# EAGLE design ab_v10 (EAGLE 6.1)
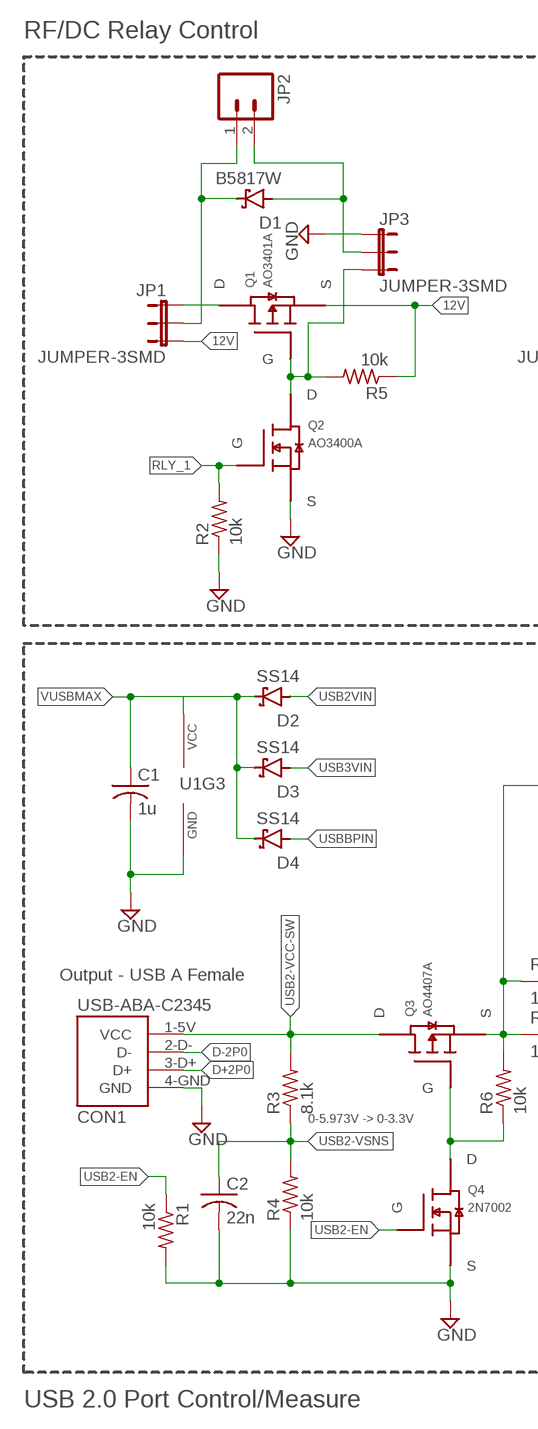
[diagram p0: schematic, sheet 1, part 1 of 2]
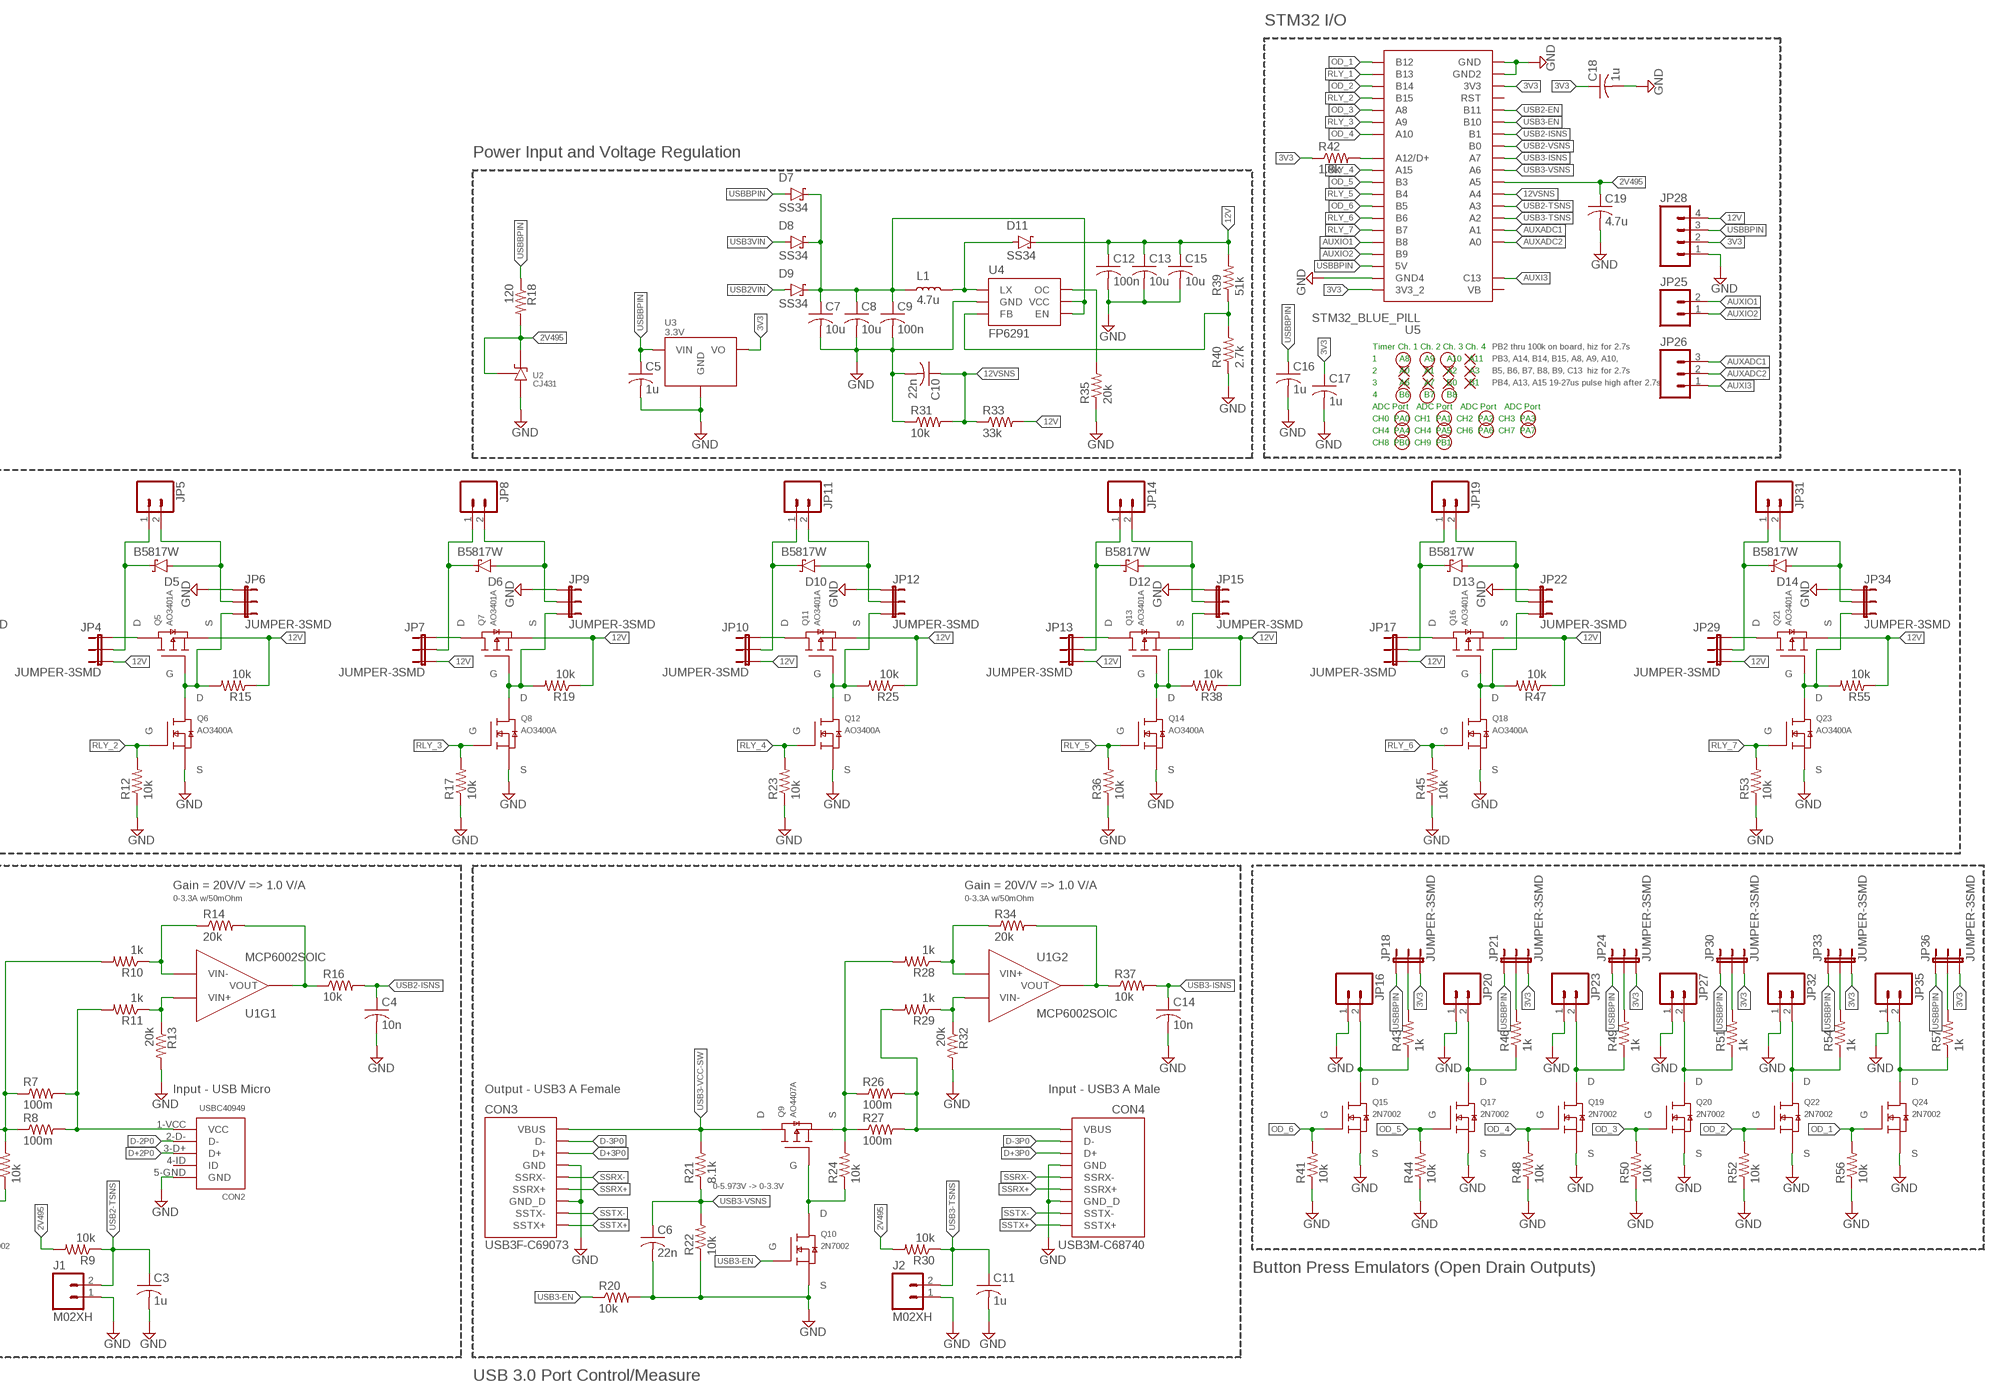
[diagram p1: schematic, sheet 1, part 2 of 2]

## Parts
C1  1u  C-USC0402  [C0402]
C2  22n  C-USC0402  [C0402]
C3  1u  C-USC0402  [C0402]
C4  10n  C-USC0402  [C0402]
C5  1u  C-USC0402  [C0402]
C6  22n  C-USC0402  [C0402]
C7  10u  C-USC0603  [C0603]
C8  10u  C-USC0603  [C0603]
C9  100n  C-USC0402  [C0402]
C10  22n  C-USC0402  [C0402]
C11  1u  C-USC0402  [C0402]
C12  100n  C-USC0402  [C0402]
C13  10u  C-USC0805  [C0805]
C14  10n  C-USC0402  [C0402]
C15  10u  C-USC0805  [C0805]
C16  1u  C-USC0402  [C0402]
C17  1u  C-USC0402  [C0402]
C18  1u  C-USC0402  [C0402]
C19  4.7u  C-USC0402  [C0402]
CON1  USB-ABA-C2345  [USB_A_C2345]
CON2  USBC40949  [MICRO_USB-B_C40949]
CON3  USB3F-C69073  [USB3-F-C69073]
CON4  USB3M-C68740  [USB3-M-C68740]
D1  B5817W  PMEG3020ER  [SOD123W]
D2  SS14  DIODE_SCHOTTKY_SMSSMA  [SMA]
D3  SS14  DIODE_SCHOTTKY_SMSSMA  [SMA]
D4  SS14  DIODE_SCHOTTKY_SMSSMA  [SMA]
D5  B5817W  PMEG3020ER  [SOD123W]
D6  B5817W  PMEG3020ER  [SOD123W]
D7  SS34  DIODE_SCHOTTKY_SMSSMA  [SMA]
D8  SS34  DIODE_SCHOTTKY_SMSSMA  [SMA]
D9  SS34  DIODE_SCHOTTKY_SMSSMA  [SMA]
D10  B5817W  PMEG3020ER  [SOD123W]
D11  SS34  DIODE_SCHOTTKY_SMSSMA  [SMA]
D12  B5817W  PMEG3020ER  [SOD123W]
D13  B5817W  PMEG3020ER  [SOD123W]
D14  B5817W  PMEG3020ER  [SOD123W]
J1  M02XH  [B2B-XH-A]
J2  M02XH  [B2B-XH-A]
JP1  JUMPER-3SMD  [SJ_3]
JP2  M02PTH  [1X02]
JP3  JUMPER-3SMD  [SJ_3]
JP4  JUMPER-3SMD  [SJ_3]
JP5  M02PTH  [1X02]
JP6  JUMPER-3SMD  [SJ_3]
JP7  JUMPER-3SMD  [SJ_3]
JP8  M02PTH  [1X02]
JP9  JUMPER-3SMD  [SJ_3]
JP10  JUMPER-3SMD  [SJ_3]
JP11  M02PTH  [1X02]
JP12  JUMPER-3SMD  [SJ_3]
JP13  JUMPER-3SMD  [SJ_3]
JP14  M02PTH  [1X02]
JP15  JUMPER-3SMD  [SJ_3]
JP16  M02PTH  [1X02]
JP17  JUMPER-3SMD  [SJ_3]
JP18  JUMPER-3SMD  [SJ_3]
JP19  M02PTH  [1X02]
JP20  M02PTH  [1X02]
JP21  JUMPER-3SMD  [SJ_3]
JP22  JUMPER-3SMD  [SJ_3]
JP23  M02PTH  [1X02]
JP24  JUMPER-3SMD  [SJ_3]
JP25  M02PTH  [1X02]
JP26  M03PTH  [1X03]
JP27  M02PTH  [1X02]
JP28  M04PTH  [1X04]
JP29  JUMPER-3SMD  [SJ_3]
JP30  JUMPER-3SMD  [SJ_3]
JP31  M02PTH  [1X02]
JP32  M02PTH  [1X02]
JP33  JUMPER-3SMD  [SJ_3]
JP34  JUMPER-3SMD  [SJ_3]
JP35  M02PTH  [1X02]
JP36  JUMPER-3SMD  [SJ_3]
L1  4.7u  INDUCTOR6X6  [INDUCTOR_6X6]
Q1  AO3401A  [SOT23]
Q2  AO3400A  2N7002P  [SOT23]
Q3  AO4407A  P-MOSFET-SOIC8  [8-SOIC]
Q4  2N7002  2N7002P  [SOT23]
Q5  AO3401A  [SOT23]
Q6  AO3400A  2N7002P  [SOT23]
Q7  AO3401A  [SOT23]
Q8  AO3400A  2N7002P  [SOT23]
Q9  AO4407A  P-MOSFET-SOIC8  [8-SOIC]
Q10  2N7002  2N7002P  [SOT23]
Q11  AO3401A  [SOT23]
Q12  AO3400A  2N7002P  [SOT23]
Q13  AO3401A  [SOT23]
Q14  AO3400A  2N7002P  [SOT23]
Q15  2N7002  2N7002P  [SOT23]
Q16  AO3401A  [SOT23]
Q17  2N7002  2N7002P  [SOT23]
Q18  AO3400A  2N7002P  [SOT23]
Q19  2N7002  2N7002P  [SOT23]
Q20  2N7002  2N7002P  [SOT23]
Q21  AO3401A  [SOT23]
Q22  2N7002  2N7002P  [SOT23]
Q23  AO3400A  2N7002P  [SOT23]
Q24  2N7002  2N7002P  [SOT23]
R1  10k  R-US_R0402  [R0402]
R2  10k  R-US_R0402  [R0402]
R3  8.1k  R-US_R0402  [R0402]
R4  10k  R-US_R0402  [R0402]
R5  10k  R-US_R0402  [R0402]
R6  10k  R-US_R0402  [R0402]
R7  100m  R-US_R1206  [R1206]
R8  100m  R-US_R1206  [R1206]
R9  10k  R-US_R0402  [R0402]
R10  1k  R-US_R0402  [R0402]
R11  1k  R-US_R0402  [R0402]
R12  10k  R-US_R0402  [R0402]
R13  20k  R-US_R0402  [R0402]
R14  20k  R-US_R0402  [R0402]
R15  10k  R-US_R0402  [R0402]
R16  10k  R-US_R0402  [R0402]
R17  10k  R-US_R0402  [R0402]
R18  120  R-US_R0402  [R0402]
R19  10k  R-US_R0402  [R0402]
R20  10k  R-US_R0402  [R0402]
R21  8.1k  R-US_R0402  [R0402]
R22  10k  R-US_R0402  [R0402]
R23  10k  R-US_R0402  [R0402]
R24  10k  R-US_R0402  [R0402]
R25  10k  R-US_R0402  [R0402]
R26  100m  R-US_R1206  [R1206]
R27  100m  R-US_R1206  [R1206]
R28  1k  R-US_R0402  [R0402]
R29  1k  R-US_R0402  [R0402]
R30  10k  R-US_R0402  [R0402]
R31  10k  R-US_R0402  [R0402]
R32  20k  R-US_R0402  [R0402]
R33  33k  R-US_R0402  [R0402]
R34  20k  R-US_R0402  [R0402]
R35  20k  R-US_R0402  [R0402]
R36  10k  R-US_R0402  [R0402]
R37  10k  R-US_R0402  [R0402]
R38  10k  R-US_R0402  [R0402]
R39  51k  R-US_R0402  [R0402]
R40  2.7k  R-US_R0402  [R0402]
R41  10k  R-US_R0402  [R0402]
R42  1.8k  R-US_R0402  [R0402]
R43  1k  R-US_R0402  [R0402]
R44  10k  R-US_R0402  [R0402]
R45  10k  R-US_R0402  [R0402]
R46  1k  R-US_R0402  [R0402]
R47  10k  R-US_R0402  [R0402]
R48  10k  R-US_R0402  [R0402]
R49  1k  R-US_R0402  [R0402]
R50  10k  R-US_R0402  [R0402]
R51  1k  R-US_R0402  [R0402]
R52  10k  R-US_R0402  [R0402]
R53  10k  R-US_R0402  [R0402]
R54  1k  R-US_R0402  [R0402]
R55  10k  R-US_R0402  [R0402]
R56  10k  R-US_R0402  [R0402]
R57  1k  R-US_R0402  [R0402]
U1  MCP6002SOIC  [8-SOIC]
U2  CJ431  TL431SOT23  [SOT23]
U3  3.3V  AP1117UR133-B  [SOT-89]
U4  FP6291  [SOT23-6]
U5  STM32_BLUE_PILL  [STM32_BLUE_PILL_USABLE]

## Nets
2V495: C19.1 R9.2 R18.2 R30.2 U2.1(K) U2.2(REF) U5.A5
3V3: C17.1 C18.1 JP18.3 JP21.3 JP24.3 JP28.2 JP30.3 JP33.3 JP36.3 R42.1 U3.1(VO) U5.3V3 U5.3V3_2
12V: C12.1 C13.1 C15.1 D11.K(CATHODE) JP1.3 JP4.3 JP7.3 JP10.3 JP13.3 JP17.3 JP28.4 JP29.3 Q1.2(S) Q5.2(S) Q7.2(S) Q11.2(S) Q13.2(S) Q16.2(S) Q21.2(S) R5.1 R15.1 R19.1 R25.1 R33.2 R38.1 R39.2 R47.1 R55.1
12VSNS: C10.1 R31.2 R33.1 U5.A4
AUXADC1: JP26.3 U5.A1
AUXADC2: JP26.2 U5.A0
AUXI3: JP26.1 U5.C13
AUXIO1: JP25.2 U5.B8
AUXIO2: JP25.1 U5.B9
BOOSTVCC: C7.1 C8.1 C9.1 D7.K(CATHODE) D8.K(CATHODE) D9.K(CATHODE) L1.1 U4.4(EN) U4.5(VCC)
D+2P0: CON1.3-D+(D+) CON2.3-D+(D+)
D+3P0: CON3.3-D+(D+) CON4.3-D+(D+)
D-2P0: CON1.2-D-(D-) CON2.2-D-(D-)
D-3P0: CON3.2-D-(D-) CON4.2-D-(D-)
FB: R39.1 R40.2 U4.3(FB)
GND: C1.2 C2.2 C3.2 C4.2 C5.2 C6.2 C7.2 C8.2 C9.2 C10.2 C11.2 C12.2 C13.2 C14.2 C15.2 C16.2 C17.2 C18.2 C19.2 CON1.4-GND(GND) CON2.5-GND(GND) CON3.4-GND(GND) CON3.7-GND(GND_D) CON4.4-GND(GND) CON4.7-GNDD(GND_D) J1.1 J2.1 JP3.1 JP6.1 JP9.1 JP12.1 JP15.1 JP16.1 JP20.1 JP22.1 JP23.1 JP27.1 JP28.1 JP32.1 JP34.1 JP35.1 Q2.2(S) Q4.2(S) Q6.2(S) Q8.2(S) Q10.2(S) Q12.2(S) Q14.2(S) Q15.2(S) Q17.2(S) Q18.2(S) Q19.2(S) Q20.2(S) Q22.2(S) Q23.2(S) Q24.2(S) R1.2 R2.1 R4.1 R12.1 R13.2 R17.1 R20.2 R22.1 R23.1 R31.1 R32.2 R35.1 R36.1 R40.1 R41.1 R44.1 R45.1 R48.1 R50.1 R52.1 R53.1 R56.1 U1.4(GND) U2.3(A) U3.2(GND) U3.2@1(GND) U4.2(GND) U5.GND U5.GND2 U5.GND4
N$1: JP16.2 Q15.3(D) R43.1
N$2: Q9.4(G) Q10.3(D) R24.1
N$3: R10.1 R14.1 U1.2(VIN-)
N$4: R11.1 R13.1 U1.3(VIN+)
N$5: JP21.2 R46.2
N$6: JP18.2 R43.2
N$7: Q3.4(G) Q4.3(D) R6.1
N$8: JP20.2 Q17.3(D) R46.1
N$9: JP24.2 R49.2
N$10: JP23.2 Q19.3(D) R49.1
N$11: JP30.2 R51.2
N$12: JP27.2 Q20.3(D) R51.1
N$13: JP33.2 R54.2
N$14: JP32.2 Q22.3(D) R54.1
N$15: JP36.2 R57.2
N$16: R28.1 R34.1 U1.5(VIN+)
N$17: R29.1 R32.1 U1.6(VIN-)
N$18: JP35.2 Q24.3(D) R57.1
N$20: JP6.3 Q5.1(G) Q6.3(D) R15.2
N$26: R42.2 U5.A12(A12/D+)
OC: R35.2 U4.6(OC)
OD_1: Q24.1(G) R56.2 U5.B12
OD_2: Q22.1(G) R52.2 U5.B14
OD_3: Q20.1(G) R50.2 U5.A8
OD_4: Q19.1(G) R48.2 U5.A10
OD_5: Q17.1(G) R44.2 U5.B3
OD_6: Q15.1(G) R41.2 U5.B5
RLY1-SW: D1.K(CATHODE) JP1.2 JP2.1
RLY1-SW1: D5.K(CATHODE) JP4.2 JP5.1
RLY1-SW2: D6.K(CATHODE) JP7.2 JP8.1
RLY1-SW3: D10.K(CATHODE) JP10.2 JP11.1
RLY1-SW4: D12.K(CATHODE) JP13.2 JP14.1
RLY1-SW5: D13.K(CATHODE) JP17.2 JP19.1
RLY1-SW6: D14.K(CATHODE) JP29.2 JP31.1
RLY1D: JP1.1 Q1.3(D)
RLY1D1: JP4.1 Q5.3(D)
RLY1D2: JP7.1 Q7.3(D)
RLY1D3: JP10.1 Q11.3(D)
RLY1D4: JP13.1 Q13.3(D)
RLY1D5: JP17.1 Q16.3(D)
RLY1D6: JP29.1 Q21.3(D)
RLY1DG: JP3.3 Q1.1(G) Q2.3(D) R5.2
RLY1DG2: JP9.3 Q7.1(G) Q8.3(D) R19.2
RLY1DG3: JP12.3 Q11.1(G) Q12.3(D) R25.2
RLY1DG4: JP15.3 Q13.1(G) Q14.3(D) R38.2
RLY1DG5: JP22.3 Q16.1(G) Q18.3(D) R47.2
RLY1DG6: JP34.3 Q21.1(G) Q23.3(D) R55.2
RLY1SPLY: D1.A(ANODE) JP2.2 JP3.2
RLY1SPLY1: D5.A(ANODE) JP5.2 JP6.2
RLY1SPLY2: D6.A(ANODE) JP8.2 JP9.2
RLY1SPLY3: D10.A(ANODE) JP11.2 JP12.2
RLY1SPLY4: D12.A(ANODE) JP14.2 JP15.2
RLY1SPLY5: D13.A(ANODE) JP19.2 JP22.2
RLY1SPLY6: D14.A(ANODE) JP31.2 JP34.2
RLY_1: Q2.1(G) R2.2 U5.B13
RLY_2: Q6.1(G) R12.2 U5.B15
RLY_3: Q8.1(G) R17.2 U5.A9
RLY_4: Q12.1(G) R23.2 U5.A15
RLY_5: Q14.1(G) R36.2 U5.B4
RLY_6: Q18.1(G) R45.2 U5.B6
RLY_7: Q23.1(G) R53.2 U5.B7
SSRX+: CON3.6-SSRX+(SSRX+) CON4.6-SSRX+(SSRX+)
SSRX-: CON3.5-SSRX-(SSRX-) CON4.5-SSRX-(SSRX-)
SSTX+: CON3.9-SSTX+(SSTX+) CON4.9-SSTX+(SSTX+)
SSTX-: CON3.8-SSTX-(SSTX-) CON4.8-SSTX-(SSTX-)
SW: D11.A(ANODE) L1.2 U4.1(LX)
USB2-EN: Q4.1(G) R1.1 U5.B11
USB2-ISNS: C4.1 R16.2 U5.B1
USB2-ISNS-R: R14.2 R16.1 U1.1(VOUT)
USB2-TSNS: C3.1 J1.2 R9.1 U5.A3
USB2-VCC-SW: CON1.1-5V(VCC) Q3.5(D) Q3.6(D) Q3.7(D) Q3.8(D) R3.2
USB2-VSNS: C2.1 R3.1 R4.2 U5.B0
USB2VIN: CON2.1-VCC(VCC) D2.A(ANODE) D9.A(ANODE) R7.2 R8.2 R11.2
USB3-EN: Q10.1(G) R20.1 U5.B10
USB3-ISNS: C14.1 R37.2 U5.A7
USB3-ISNS-R: R34.2 R37.1 U1.7(VOUT)
USB3-TSNS: C11.1 J2.2 R30.1 U5.A2
USB3-VCC-SW: CON3.1-VBUS(VBUS) Q9.5(D) Q9.6(D) Q9.7(D) Q9.8(D) R21.2
USB3-VSNS: C6.1 R21.1 R22.2 U5.A6
USB3OUTVCC: Q9.1(S) Q9.2(S) Q9.3(S) R24.2 R26.1 R27.1 R28.2
USB3VIN: CON4.1-VBUS(VBUS) D3.A(ANODE) D8.A(ANODE) R26.2 R27.2 R29.2
USBBPIN: C5.1 C16.1 D4.A(ANODE) D7.A(ANODE) JP18.1 JP21.1 JP24.1 JP28.3 JP30.1 JP33.1 JP36.1 R18.1 U3.3(VIN) U5.5V
USBOUTVCC: Q3.1(S) Q3.2(S) Q3.3(S) R6.2 R7.1 R8.1 R10.2
VUSBMAX: C1.1 D2.K(CATHODE) D3.K(CATHODE) D4.K(CATHODE) U1.8(VCC)
Unconnected: CON2.4-ID(ID) U5.RST U5.VBAT(VB)

## Notes on the sheet
- STM32 I/O
- Power Input and Voltage Regulation
- Timer Ch. 1 Ch. 2 Ch. 3 Ch. 4 | PB2 thru 100k on board, hiz for 2.7s
- 1         A8      A9     A10   A11 | PB3, A14, B14, B15, A8, A9, A10,
- 2         A0      A1     A2     A3 | B5, B6, B7, B8, B9, C13  hiz for 2.7s
- 3         A6      A7     B0     B1 | PB4, A13, A15 19-27us pulse high after 2.7s
- 4         B6      B7     B8
- ADC Port   ADC Port   ADC Port   ADC Port
- CH0  PA0  CH1  PA1  CH2  PA2  CH3  PA3
- CH4  PA4  CH4  PA5  CH6  PA6  CH7  PA7
- CH8  PB0  CH9  PB1
- RF/DC Relay Control
- Gain = 20V/V => 1.0 V/A | Gain = 20V/V => 1.0 V/A
- 0-3.3A w/50mOhm | 0-3.3A w/50mOhm
- Output - USB A Female | Input - USB Micro | Output - USB3 A Female | Input - USB3 A Male
- 0-5.973V -> 0-3.3V | 0-5.973V -> 0-3.3V
- Button Press Emulators (Open Drain Outputs)
- USB 2.0 Port Control/Measure | USB 3.0 Port Control/Measure

## Library data of the parts
C1-C19 = resistor:C-US: CAPACITOR, American symbol
CON1 = custom:USB-AB
CON2 = custom:USB
CON3 CON4 = custom:USB3
D1 D5 D6 D10 D12-D14 = custom:PMEG3020ER: Schottky Diode 30V 2A 0.42V 1.5mA Leakage
D2-D4 D7-D9 D11 = custom:DIODE_SCHOTTKY_SMS
J1 J2 = custom:M02: 2-pin Header
JP1 JP3 JP4 JP6 JP7 JP9 JP10 JP12 JP13 JP15 JP17 JP18 JP21 JP22 JP24 JP29 JP30 JP33 JP34 JP36 = SparkFun:JUMPER-3
JP2 JP5 JP8 JP11 JP14 JP16 JP19 JP20 JP23 JP25 JP27 JP31 JP32 JP35 = SparkFun:M02: Header 2 Standard 2-pin 0.1" header. Use with straight break away headers (SKU : PRT-00116), right angle break away headers (PRT-00553), swiss pins (PRT-00743), machine pins (PRT-00117), and female headers (PRT-00115). Molex polarized connector foot print use with SKU : PRT-08233 with associated crimp pins and housings.
JP26 = SparkFun:M03: Header 3 Standard 3-pin 0.1" header. Use with straight break away headers (SKU : PRT-00116), right angle break away headers (PRT-00553), swiss pins (PRT-00743), machine pins (PRT-00117), and female headers (PRT-00115). Molex polarized connector foot print use with SKU : PRT-08232 with associated crimp pins and housings.
JP28 = SparkFun:M04: Header 4 Standard 4-pin 0.1" header. Use with straight break away headers (SKU : PRT-00116), right angle break away headers (PRT-00553), swiss pins (PRT-00743), machine pins (PRT-00117), and female headers (PRT-00115). Molex polarized connector foot print use with SKU : PRT-08231 with associated crimp pins and housings. 1MM SMD Version SKU: PRT-10208
L1 = custom:INDUCTOR
Q1 Q5 Q7 Q11 Q13 Q16 Q21 = custom:AO3401A: P-Channel MOSFET 30V 4A Logic Level 2.5V 44mOhm
Q2 Q4 Q6 Q8 Q10 Q12 Q14 Q15 Q17-Q20 Q22-Q24 = custom:2N7002P: 2N7002P N-channel MOSFET 60V 360mA Logic Level
Q3 Q9 = custom:P-MOSFET-SOIC8
R1-R57 = resistor:R-US_: RESISTOR, American symbol
U1 = custom:MCP6002: Op-Amp Dual Rail-to-Rail 1MHz
U2 = custom:TL431: Shunt Voltage Reference IC 700uA 100mA 36V
U3 = custom:AP1117: Linear Voltage Regulator 18V Max 1A
U4 = custom:FP6291: Boost Converter Adjustable 2.6-5.5Vin 12Vout 2A
U5 = custom:STM32_BLUE_PILL

## Board
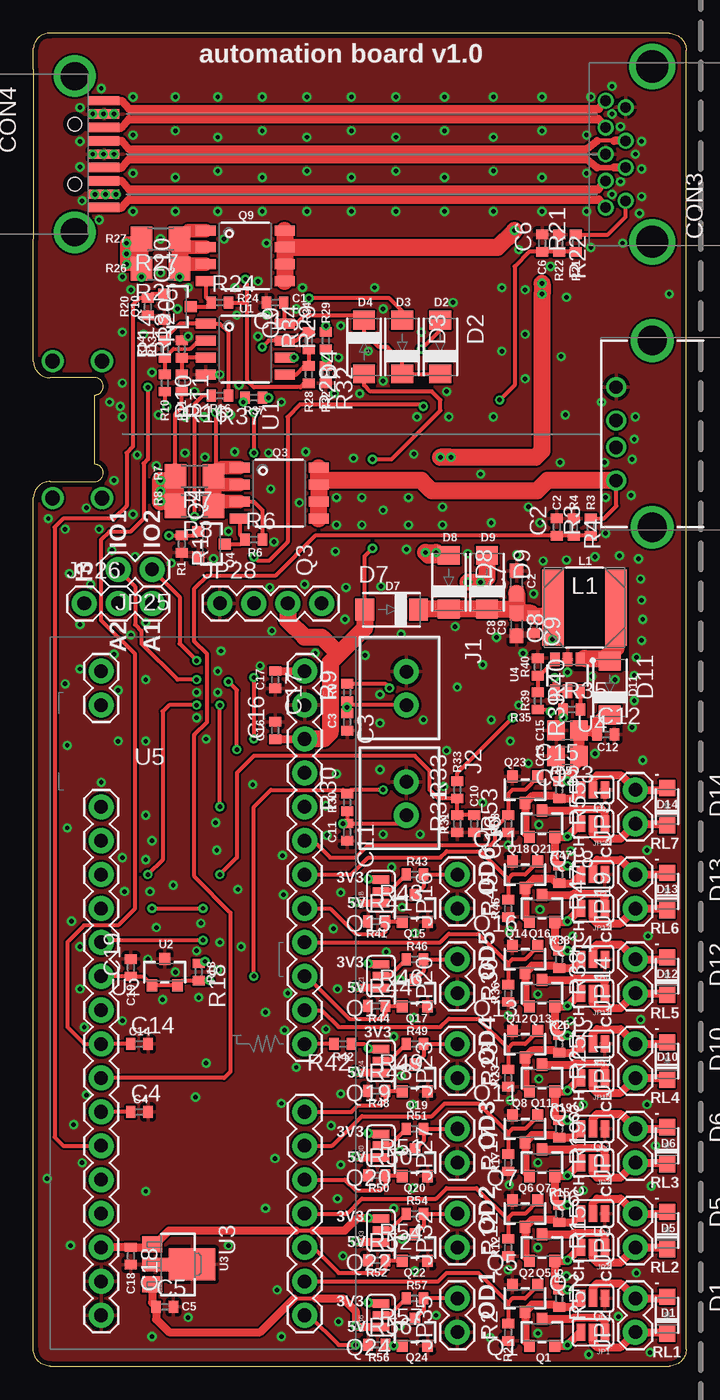
[diagram p2: board, top side]
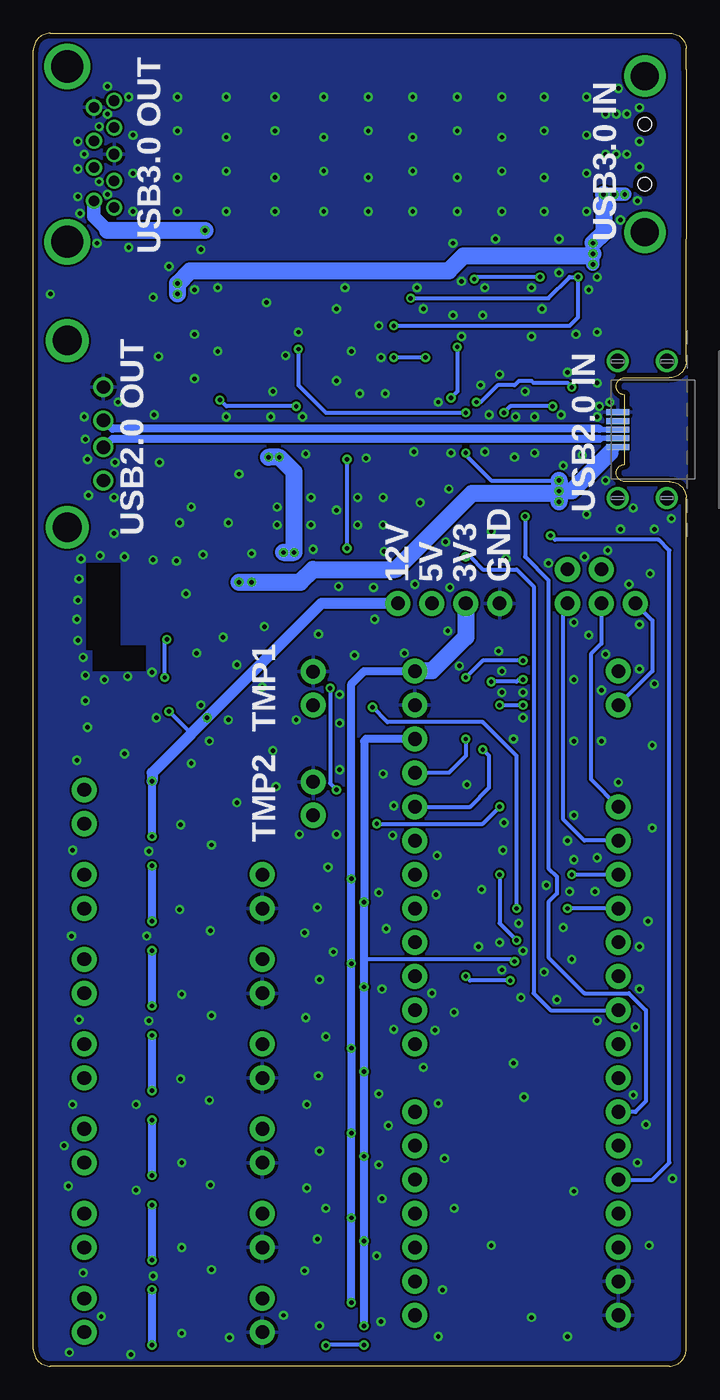
[diagram p3: board, bottom side, seen from below]

Size 48.9 x 99.86 mm. Coordinates in mm from the lower left corner, seen from the top.
Outline: 0,65.09 0,1.27 arc90 1.27,0 47.62,0 arc90 48.9,1.27 48.9,98.58 arc90 47.62,99.85 1.27,99.85 arc90 0,98.74 0,97.16
Outline: 0,75.25 0,84.45
Copper layers (1*16): Top 0.0356mm / dielectric 1.5011mm / Bottom 0.0356mm
Design rules: minimum track width 6mil, minimum drill 13mil, track to track 6mil, track to pad 6mil, pad to pad 6mil, via to via 6mil, smd to smd 6mil, copper to edge 15mil, drill to drill 6mil, minimum pad ring 7mil, minimum via ring 7mil, stop-mask expansion 4mil, vias tented up to drill 20mil, thermal gap 10mil
tRestrict: area 39.4,53.8 to 44.6,59.8; area 40.5,52.1 to 44.6,53.8
bRestrict: area 42.4,53.7 to 44.9,60.2; area 40.5,52.1 to 44.5,53.7; area 40.5,53.7 to 42.4,54

### Footprints (pad centres in the part's own frame; a part is rotated, then mirrored left to right if it is on the bottom)
C0402 = smd 0.7 x 0.9: 1 -0.65,0; 2 0.65,0
C0603 = smd 1.1 x 1: 1 -0.85,0; 2 0.85,0
C0805 = smd 1.3 x 1.5: 1 -0.85,0; 2 0.85,0
USB_A_C2345 = drill 1: 1-5V -3.5,2.71; 2-D- -1,2.71; 3-D+ 1,2.71; 4-GND 3.5,2.71 | drill 2.2: S1 -7,0; S2 7,0
MICRO_USB-B_C40949 = smd 0.45 x 1.72: 1-VCC -1.3,5.775; 2-D- -0.65,5.775; 3-D+ 0,5.775; 4-ID 0.65,5.775; 5-GND 1.3,5.775 | drill 1.1: S1 -5.125,5.775; S2 -5.125,2.075; S3 5.125,2.075; S4 5.125,5.775
USB3-F-C69073 = drill 0.8: 1-VBUS -3.5,2; 2-D- -1,2; 3-D+ 1,2; 4-GND 3.5,2; 5-SSRX- 4,3.5; 6-SSRX+ 2,3.5; 7-GND 0,3.5; 8-SSTX- -2,3.5; 9-SSTX+ -4,3.5 | drill 2.4: S1 -6.57,0; S2 6.57,0
USB3-M-C68740 = smd 0.7 x 2.3: 1-VBUS 3,2.76; 2-D- 1,2.76; 3-D+ -1,2.76; 4-GND -3,2.76; 5-SSRX- -4,2.76; 6-SSRX+ -2,2.76; 7-GNDD 0,2.76; 8-SSTX- 2,2.76; 9-SSTX+ 4,2.76 | drill 2.1: S1 -5.85,0.56; S2 5.85,0.56 | hole 1: -2.25,0.56; 2.25,0.56
SOD123W = smd 1.2 x 1.2: A -1.4,0; K 1.4,0
SMA = smd 1.4 x 1.64: A -2.015,0; K 2.015,0
B2B-XH-A = drill 1.016 pad 1.88: 1 -2.5,0; 2 0,0
SJ_3 = smd 0.635 x 1.27: 1 -0.889,0; 2 0,0; 3 0.889,0
1X02 = drill 1.016 pad 1.88: 1 0,0; 2 2.54,0
1X03 = drill 1.016 pad 1.88: 1 0,0; 2 2.54,0; 3 5.08,0
1X04 = drill 1.016 pad 1.88: 1 0,0; 2 2.54,0; 3 5.08,0; 4 7.62,0
INDUCTOR_6X6 = smd 1.6 x 5.7: 1 -2.35,0; 2 2.35,0
SOT23 = smd 0.8 x 0.9: 1 0.95,1; 2 -0.95,1; 3 0,-1
8-SOIC = smd 0.75 x 1.5: 1 -1.905,-2.95; 2 -0.635,-2.95; 3 0.635,-2.95; 4 1.905,-2.95; 5 1.905,2.95; 6 0.635,2.95; 7 -0.635,2.95; 8 -1.905,2.95
R0402 = smd 0.7 x 0.9: 1 -0.65,0; 2 0.65,0
R1206 = smd 1.6 x 1.803: 1 -1.422,0; 2 1.422,0
SOT-89 = smd 1.2 x 1.5: 1 -1.5,0; 3 1.5,0 | smd 1 x 2: 2 0,0.25 | smd 2.4 x 3.5: 2@1 0,3
SOT23-6 = smd 0.7 x 1: 1 -0.95,-1.2; 2 0,-1.2; 3 0.95,-1.2; 4 0.95,1.2; 5 0,1.2; 6 -0.95,1.2
STM32_BLUE_PILL_USABLE = drill 1.016 pad 1.88: 3V3 -7.62,-19.05; 3V3_2 7.62,24.13; 5V 7.62,19.05; A0 -7.62,13.97; A1 -7.62,11.43; A2 -7.62,8.89; A3 -7.62,6.35; A4 -7.62,3.81; A5 -7.62,1.27; A6 -7.62,-1.27; A7 -7.62,-3.81; A8 7.62,-13.97; A9 7.62,-11.43; A10 7.62,-8.89; A12 7.62,-3.81; A15 7.62,-1.27; B0 -7.62,-6.35; B1 -7.62,-8.89; B3 7.62,1.27; B4 7.62,3.81; B5 7.62,6.35; B6 7.62,8.89; B7 7.62,11.43; B8 7.62,13.97; B9 7.62,16.51; B10 -7.62,-11.43; B11 -7.62,-13.97; B12 7.62,-24.13; B13 7.62,-21.59; B14 7.62,-19.05; B15 7.62,-16.51; C13 -7.62,21.59; GND -7.62,-24.13; GND2 -7.62,-21.59; GND4 7.62,21.59; RST -7.62,-16.51; VBAT -7.62,24.13

### Placement (x,y rotation side)
C1  18.1,79.69 180 top
C2  39.21,62.87 90 top
C3  23.5,48.26 270 top
C4  7.94,19.05 0 top
C5  9.84,4.45 0 top
C6  38.1,84.14 90 top
C7  36.2,58.74 90 top
C8  36.2,55.56 270 top
C9  37.47,55.56 270 top
C10  33.02,40.64 270 top
C11  23.5,40.01 270 top
C12  42.86,47.31 0 top
C13  40.01,45.72 180 top
C14  7.94,24.13 0 top
C15  40.01,47.62 180 top
C16  18.1,47.62 90 top
C17  18.1,51.44 270 top
C18  7.3,8.26 270 top
C19  7.3,29.84 90 top
CON1  46.35,69.85 90 top
CON2  -0.64,70.17 90 bottom
CON3  46.35,90.81 90 top
CON4  2.54,90.81 270 top
D1  47.47,3.81 270 top
D2  30.48,76.36 270 top
D3  27.62,76.36 270 top
D4  24.77,76.36 90 top
D5  47.47,10.16 270 top
D6  47.47,16.51 270 top
D7  26.83,56.67 0 top
D8  31.11,58.74 270 top
D9  33.97,58.74 270 top
D10  47.47,22.86 270 top
D11  43.18,50.8 270 top
D12  47.47,29.21 270 top
D13  47.47,35.56 270 top
D14  47.47,41.91 270 top
J1  27.94,49.53 270 top
J2  27.94,41.27 270 top
JP1  41.91,2.54 180 top
JP2  45.09,2.54 90 top
JP3  41.91,5.08 180 top
JP4  41.91,8.89 180 top
JP5  45.09,8.89 90 top
JP6  41.91,11.43 180 top
JP7  41.91,15.24 180 top
JP8  45.09,15.24 90 top
JP9  41.91,17.78 180 top
JP10  41.91,21.59 180 top
JP11  45.09,21.59 90 top
JP12  41.91,24.13 180 top
JP13  41.91,27.94 180 top
JP14  45.09,27.94 90 top
JP15  41.91,30.48 180 top
JP16  31.75,34.29 90 top
JP17  41.91,34.29 180 top
JP18  26.04,35.56 90 top
JP19  45.09,34.29 90 top
JP20  31.75,27.94 90 top
JP21  26.04,29.21 90 top
JP22  41.91,36.83 180 top
JP23  31.75,21.59 90 top
JP24  26.04,22.86 90 top
JP25  8.89,59.69 180 top
JP26  3.81,57.15 0 top
JP27  31.75,15.24 90 top
JP28  13.97,57.15 0 top
JP29  41.91,40.64 180 top
JP30  26.04,16.51 90 top
JP31  45.09,40.64 90 top
JP32  31.75,8.89 90 top
JP33  26.04,10.16 90 top
JP34  41.91,43.18 180 top
JP35  31.75,2.54 90 top
JP36  26.04,3.81 90 top
L1  41.27,56.83 0 top
Q1  38.1,2.54 180 top
Q2  36.83,5.08 0 top
Q3  18.41,65.41 270 top
Q4  13.34,61.59 90 top
Q5  38.1,8.89 180 top
Q6  36.83,11.43 0 top
Q7  38.1,15.24 180 top
Q8  36.83,17.78 0 top
Q9  15.88,83.19 270 top
Q10  10.79,79.38 90 top
Q11  38.1,21.59 180 top
Q12  36.83,24.13 0 top
Q13  38.1,27.94 180 top
Q14  36.83,30.48 0 top
Q15  28.57,34.29 180 top
Q16  38.1,34.29 180 top
Q17  28.57,27.94 180 top
Q18  36.83,36.83 0 top
Q19  28.57,21.59 180 top
Q20  28.57,15.24 180 top
Q21  38.1,40.64 180 top
Q22  28.57,8.89 180 top
Q23  36.83,43.18 0 top
Q24  28.57,2.54 180 top
R1  11.11,61.59 270 top
R2  35.56,2.54 90 top
R3  41.75,62.87 90 top
R4  40.48,62.87 270 top
R5  39.37,5.08 270 top
R6  16.51,61.91 0 top
R7  12.06,66.67 180 top
R8  12.06,64.45 180 top
R9  23.5,50.48 90 top
R10  9.84,73.66 270 top
R11  11.11,73.66 270 top
R12  35.56,8.89 90 top
R13  11.11,76.2 90 top
R14  9.84,76.2 90 top
R15  39.37,11.43 270 top
R16  13.97,72.71 180 top
R17  35.56,15.24 90 top
R18  12.38,29.53 270 top
R19  39.37,17.78 270 top
R20  8.57,79.38 270 top
R21  40.64,84.14 90 top
R22  39.37,84.14 270 top
R23  35.56,21.59 90 top
R24  13.97,79.69 0 top
R25  39.37,24.13 270 top
R26  9.53,82.23 180 top
R27  9.53,84.45 180 top
R28  20.64,74.3 270 top
R29  21.91,76.83 90 top
R30  23.5,42.23 90 top
R31  31.75,40.64 90 top
R32  21.91,74.3 270 top
R33  31.75,43.18 90 top
R34  20.64,76.83 90 top
R35  40.32,49.21 0 top
R36  35.56,27.94 90 top
R37  16.51,72.55 180 top
R38  39.37,30.48 270 top
R39  37.78,49.85 270 top
R40  37.78,52.39 270 top
R41  25.72,33.34 0 top
R42  23.18,24.13 180 top
R43  28.57,36.83 180 top
R44  25.72,26.99 0 top
R45  35.56,34.29 90 top
R46  28.57,30.48 180 top
R47  39.37,36.83 270 top
R48  25.72,20.64 0 top
R49  28.57,24.13 180 top
R50  25.72,14.29 0 top
R51  28.57,17.78 180 top
R52  25.72,7.94 0 top
R53  35.56,40.64 90 top
R54  28.57,11.43 180 top
R55  39.37,43.18 270 top
R56  25.72,1.59 0 top
R57  28.57,5.08 180 top
U1  15.88,76.2 270 top
U2  9.84,29.53 180 top
U3  8.89,7.62 270 top
U4  40.01,51.75 180 top
U5  12.7,27.94 0 top

### Tracks (layer width: path | path; a pad name or v marks a point on that pad's centre or on a via)
2V495  (via drill 0.33)
  Top 0.305: U5.A5 5.09,29.2 C19.1 8.22,29.2 U2.1 U2.2 11.14,28.88 R18.2 13.16,28.88 v13.18,28.89 | v16.51,29.21 16.51,41.91 17.78,43.18 23.19,43.18 R30.2 23.8,43.18 v26.19,43.18 | R9.2 26.34,51.13 v26.67,50.8
  Bottom 0.305: v13.18,28.89 16.19,28.89 v16.51,29.21 | v26.67,50.8 26.67,43.66 v26.19,43.18
3V3  (via drill 0.33)
  Top 0.305: R42.1 24.77,24.13 v25.08,23.81 | 19.68,10.16 20.95,10.16
  Top 0.61: JP36.3 25.15,4.7 v25.08,4.76 | JP33.3 25.15,11.05 v25.08,11.11 24.29,11.11 23.34,10.16 20.95,10.16 | JP30.3 25.15,17.4 v25.08,17.46 | JP24.3 25.15,23.75 v25.08,23.81 | JP21.3 25.15,30.1 v25.08,30.16 | JP18.3 25.15,36.45 v25.08,36.51 | U5.3V3 5.09,8.9 C18.1 8.68,8.9 U3.1 9.12,9.12 10.16,10.16 19.68,10.16 | C17.1 20.3,52.09 U5.3V3_2
  Bottom 0.61: v25.08,4.76 v25.08,11.11 v25.08,17.46 v25.08,23.81 v25.08,30.16 v25.08,36.51 25.08,51.12 24.13,52.07 U5.3V3_2
  Bottom 1.27: JP28.2 16.51,54.62 19.05,52.09 20.3,52.09 U5.3V3_2
12V  (via drill 0.33)
  Top 0.305: R39.2 38.59,49.2 v38.73,49.05 | R33.2 31.75,44.45 v35.88,48.59
  Top 0.61: v40.01,5.73 R5.1 39.05,6.05 Q5.2 39.96,7.89 v40.01,7.94 40.96,8.89 JP4.3 | v40.01,12.08 R15.1 39.05,12.4 Q7.2 39.96,14.24 v40.01,14.29 40.96,15.24 JP7.3 | v40.01,18.43 R19.1 39.05,18.75 Q11.2 39.96,20.59 v40.01,20.64 40.96,21.59 JP10.3 | v40.01,24.78 R25.1 39.05,25.1 Q13.2 39.96,26.94 v40.01,26.99 40.96,27.94 JP13.3 | v40.01,31.13 R38.1 39.05,31.45 Q16.2 39.96,33.29 v40.01,33.34 40.96,34.29 JP17.3 | v40.01,37.48 R47.1 39.05,37.8 Q21.2 39.96,39.64 v40.01,39.69 40.96,40.64 JP29.3 | R55.1 v40.01,43.83 40.01,44.29 40.85,45.14 C13.1 | Q1.2 39.96,1.54 v40.01,1.59 40.96,2.54 JP1.3
  Top 0.813: D11.K 42.75,48.78 42.21,48.24 C12.1 41.9,47.62 C15.1 C13.1
  Bottom 0.305: v38.73,49.05 37.08,47.39
  Bottom 0.61: v40.01,1.59 v40.01,5.73 | v40.01,7.94 v40.01,12.08 | v40.01,14.29 v40.01,18.43 | v40.01,20.64 v40.01,24.78 | v40.01,26.99 v40.01,31.13 | v40.01,33.34 v40.01,37.48 | v40.01,39.69 v40.01,43.83
  Bottom 0.813: JP28.4 27.32,57.15 v35.88,48.59 37.08,47.39 37.08,47.38 40.01,44.45 v40.01,43.83
12VSNS  (via drill 0.33)
  Top 0.305: C10.1 R31.2 R33.1 30.34,42.53 29.69,43.18 29.69,44.61 28.57,45.72 16.51,45.72 15.24,44.45 15.24,38.1 v13.97,36.83 | v12.7,31.91 5.24,31.91 U5.A4
  Bottom 0.305: v13.97,36.83 13.97,33.18 v12.7,31.91
AUXADC1
  Bottom 0.305: U5.A1 7.62,39.37 9.21,40.96 9.21,56.83 JP26.3
AUXADC2
  Bottom 0.305: JP26.2 6.35,54.13 7.14,53.34 7.14,43.97 U5.A0
AUXI3
  Bottom 0.305: JP26.1 2.54,55.88 2.54,52.07 U5.C13
AUXIO1  (via drill 0.33)
  Top 0.305: v15.24,46.2 15.24,50.64 v14.61,51.28 | v12.22,51.44 10.79,51.44 8.1,54.13 8.1,55.09 7.62,55.56 7.62,58.42 JP25.2
  Bottom 0.305: U5.B8 16.19,41.91 14.76,43.34 14.76,45.72 v15.24,46.2 | v12.22,51.44 12.54,51.44 12.7,51.28 v14.61,51.28
AUXIO2  (via drill 0.33)
  Top 0.305: JP25.1 10.95,57.63 10.95,54.13 v12.22,52.86 | v16.51,51.59 v16.51,46.99
  Bottom 0.305: v12.22,52.86 15.24,52.86 v16.51,51.59 | v16.51,46.99 16.51,45.72 17.78,44.45 U5.B9
BOOSTVCC  (via drill 0.33)
  Top 0.305: U4.5 U4.4 v39.05,51.59 | 38.3,56.21 38.3,55.04 v38.89,54.45
  Top 1.27: L1.1 38.3,56.21 C9.1 37.27,56.41 C8.1 | C7.1 C8.1 | C8.1 35.88,56.72 D9.K D8.K 28.89,56.72 D7.K
  Bottom 0.305: v39.05,51.59 39.05,54.29 v38.89,54.45
D+2P0
  Bottom 0.406: CON2.3-D+ 6.35,70.17 6.51,70.23
  Bottom 0.61: 6.51,70.23 42.96,70.23 CON1.3-D+
D+3P0
  Top 0.305: 43.5,91.81 42.23,91.81
  Top 0.61: CON4.3-D+ 6.62,91.81 7.14,91.19 41.43,91.19 42.23,91.81 | CON3.3-D+ 43.5,91.81
D-2P0
  Bottom 0.406: CON2.2-D- 6.37,69.52 6.51,69.47
  Bottom 0.61: 6.51,69.47 42.96,69.47 CON1.2-D-
D-3P0
  Top 0.406: 43.5,89.81 42.23,89.81
  Top 0.61: CON4.2-D- 6.62,89.81 7.14,90.42 41.43,90.42 42.23,89.81 | CON3.2-D- 43.5,89.81
FB
  Top 0.305: R39.1 R40.2 37.93,51.74 39.05,52.87 U4.3
GND  (via drill 0.33)
  other vias: 8.41,51.44 9.21,67.47 12.86,68.1 14.76,71.28 9.37,71.28 8.26,77.31 11.59,77.15 7.46,89.38 41.43,89.38 41.43,92.23 7.46,92.23 23.18,8.26 35.56,39.05 33.66,42.23 36.35,49.53 39.69,48.58 37.94,63.18 36.2,60.8 42.86,65.09 28.1,65.09 30.64,64.37 30.64,63.02 28.1,63.02 24.61,63.02 22.7,63.02 22.7,65.09 24.61,65.09 26.19,64.14 37.07,64.37 42.86,62.39 44.77,65.25 38.1,92.55 38.1,89.06 34.45,89.53 34.45,92.08 30.8,89.06 30.8,92.55 27.15,92.08 27.15,89.53 23.81,89.06 23.81,92.55 20.48,92.08 20.48,89.53 17.14,92.55 17.14,89.06 13.81,89.53 13.81,92.08 10.64,92.55 10.64,89.06 7.46,95.09 10.64,95.09 13.81,95.09 17.14,95.09 20.48,95.09 23.81,95.09 27.15,95.09 30.8,95.09 34.45,95.09 38.1,95.09 41.75,95.09 43.97,92.87 43.97,88.74 43.34,87.79 43.34,93.82 41.43,86.52 38.1,86.52 34.45,86.52 30.8,86.52 27.15,86.52 23.81,86.52 20.48,86.52 17.14,86.52 13.81,86.52 10.64,86.52 7.46,86.52 4.92,85.88 3.65,87.31 3.49,89.85 3.49,91.76 6.03,90.81 5.24,90.81 4.45,90.81 3.49,94.3 6.03,93.82 5.24,93.82 4.45,93.82 5.08,95.73 6.67,81.6 9.53,81.92 9.53,84.45 14.29,84.45 17.46,84.14 16.83,81.28 43.34,95.89 45.56,91.76 45.09,90.81 45.56,89.69 45.56,87.63 45.4,86.36 44.13,84.14 41.75,83.82 38.73,82.39 36.35,83.66 36.83,80.64 36.83,77.31 36.83,73.98 34.45,71.12 31.11,71.12 28.73,71.12 30.96,73.03 30,75.72 29.05,77.47 35.08,80.8 35.08,76.04 31.43,79.69 25.56,80.8 20.16,80.8 19.68,79.22 26.19,79.22 23.02,77.95 22.86,75.56 26.19,73.82 25.08,76.04 24.45,72.87 22.54,72.87 18.57,72.23 16.83,77.15 17.46,78.74 15.24,78.74 15.4,73.5 13.97,74.3 12.06,73.03 8.89,74.45 10.79,79.22 11.59,80.8 15.08,80.8 7.3,80.64 6.67,77.47 6.67,73.66 6.67,71.12 6.51,71.91 5.71,72.23 6.03,66.36 7.78,68.26 7.46,63.82 4.92,62.71 2.38,62.71 3.97,64.29 1.11,63.5 4.29,58.58 5.87,61.12 7.62,60.64 10.32,60.17 13.49,60.48 14.61,62.55 8.41,55.72 7.3,54.77 6.03,53.34 3.49,55.56 3.49,52.23 2.38,51.12 6.35,50.64 6.35,46.83 8.41,37.94 8.89,39.37 8.41,41.27 8.41,46.83 12.22,48.58 10.48,36.04 6.83,35.56 6.67,38.1 8.73,35.56 9.21,32.86 12.54,33.18 8.57,30.48 10.64,29.53 12.22,31.11 13.97,31.75 13.81,29.69 12.38,27.62 9.68,27.46 6.67,25.88 3.49,28.26 3.49,31.43 2.86,33.34 2.54,40.32 2.54,46.51 3.65,15.24 3.02,18.1 3.97,20.32 3.81,25.4 14.61,9.05 11.59,3.65 8.89,2.22 18.57,2.22 18.26,5.71 22.86,3.33 27.46,3.02 30.16,3.81 28.57,7.14 27.62,9.53 26.99,11.83 28.42,13.34 23.02,15.08 22.78,12.54 27.46,16.11 22.3,18.02 28.42,19.61 27.54,21.75 23.02,20.4 26.99,24.69 28.5,26.11 27.46,28.97 22.78,28.26 19.05,27.94 18.81,25.16 21.91,25.24 22.46,32.78 28.57,32.46 26.43,31.04 23.02,35.48 27.62,34.37 26.83,37.39 28.97,39.85 26.19,39.85 21.99,39.77 18.65,38.26 18.73,35.32 16.43,43.58 22.7,44.37 25.96,44.69 30.72,43.42 30.96,46.12 25.96,48.18 25.96,50.32 34.29,48.42 35.72,46.83 37.07,45.16 42.07,45.88 44.85,47.86 45.01,49.85 40.01,51.99 41.83,51.67 43.58,51.44 45.01,51.75 45.16,53.1 45.56,54.37 45.64,55.96 45.56,57.39 45.48,58.98 45.32,60.48 43.89,60.72 42.07,60.64 39.93,60.4 38.18,60.33 37.47,57.86 36.67,53.42 34.69,54.61 31.59,55.4 33.66,52.55 31.75,50.88 29.21,48.42 27.54,54.85 24.84,53.26 23.34,55.96 26.04,58.42 23.42,58.34 27.94,61.2 22.62,61.04 32.54,60.88 34.29,63.18 39.45,67.71 42.78,67.71 44.85,67.94 45.01,69.45 45.09,71.12 42.55,72.23 39.85,71.28 28.5,68.34 23.97,68.02 20.4,68.5 19.92,64.69 17.78,65.72 17.62,68.42 47.62,80.33 39.53,75.64 39.93,80.09 2.7,59.37 2.78,9.05 1.03,14.05 18.57,19.68 18.1,15.56 17.38,11.83 8.41,13.1 12.14,20.16 19.68,22.38 17.38,26.51 12.94,22.7 15.32,35.72 15.56,31.43 13.73,38.66 13.65,40.72 12.94,46.99 5.08,43.74 14.05,53.58 16.99,52.47 21.11,53.42 17.86,55.09 17.7,58.34 20.32,58.58 18.02,61.75 15.08,68.5 11.35,68.42 12.78,71.12 11.35,71.12 33.5,66.83 35.56,7.22 37.78,8.89 39.93,6.75 45.16,6.99 43.81,3.73 37.78,2.46 41.59,0.87 46.2,1.03 34.21,2.14 35.64,13.57 37.78,15.24 41.2,13.18 46.28,13.49 46.59,16.51 41.2,19.61 45.96,19.61 35.72,19.92 37.86,21.51 35.56,26.27 37.78,27.86 40.24,25.88 45.48,25.96 46.04,32.23 40.4,32.23 35.64,32.62 37.94,34.21 37.86,40.56 40.24,38.58 45.96,38.66 45.64,45.4 21.91,41.99 12.22,50.48 13.81,50.48 13.81,52.07
  pour Bottom: 0,0 48.9,0 48.9,100.01 0,100.01
  pour Top: 0,0 48.9,0 48.9,100.01 0,100.01
N$1
  Top 0.305: Q15.3 29.23,35.94 R43.1 JP16.2
N$2
  Top 0.305: Q9.4 12.93,80.09 R24.1 13,79.38 Q10.3
N$3
  Top 0.254: 11.75,76.2 10.49,76.2
  Top 0.305: U1.2 12.38,76.83 11.75,76.2 | 10.49,76.2 R14.1 R10.1
N$4
  Top 0.305: R11.1 R13.1 11.13,75.56 U1.3
N$5
  Top 0.305: JP21.2 26.66,29.21 R46.2
N$6
  Top 0.305: JP18.2 26.66,35.56 R43.2
N$7
  Top 0.305: Q4.3 15.54,61.59 R6.1 15.46,62.31 Q3.4
N$8
  Top 0.305: Q17.3 29.23,29.59 R46.1 JP20.2
N$9
  Top 0.305: JP24.2 26.66,22.86 R49.2
N$10
  Top 0.305: Q19.3 29.23,23.24 R49.1 JP23.2
N$11
  Top 0.305: JP30.2 26.66,16.51 R51.2
N$12
  Top 0.305: Q20.3 29.23,16.89 R51.1 JP27.2
N$13
  Top 0.305: JP33.2 26.66,10.16 R54.2
N$14
  Top 0.305: JP32.2 R54.1 29.23,10.54 Q22.3
N$15
  Top 0.305: JP36.2 26.66,3.81 R57.2
N$16
  Top 0.305: U1.5 19.68,74.3 20.34,74.94 R28.1 R34.1
N$17  (via drill 0.33)
  Top 0.305: R32.1 v21.91,75.56 R29.1 | U1.6 v19.53,75.56
  Bottom 0.305: v19.53,75.56 v21.91,75.56
N$18
  Top 0.305: JP35.2 R57.1 29.23,4.19 Q24.3
N$20
  Top 0.61: Q5.1 36.83,8.21 Q6.3 37.35,10.95 39.05,10.95 39.23,10.78 R15.2 40.37,10.78 JP6.3
N$26
  Top 0.305: R42.2 U5.A12
OC
  Top 0.305: U4.6 40.95,49.23 R35.2
OD_1  (via drill 0.33)
  Top 0.305: Q24.1 v26.99,1.54 26.41,1.54 R56.2 | U5.B12 20.64,3.81 22.86,1.59 v24.13,1.59
  Bottom 0.305: v24.13,1.59 26.94,1.59 v26.99,1.54
OD_2
  Top 0.305: Q22.1 27.58,7.94 R52.2 26.37,7.16 26.19,6.99 22.86,6.99 20.95,8.89 U5.B14
OD_3
  Top 0.305: Q20.1 27.58,14.29 R50.2 26.37,13.51 26.04,13.18 24.13,13.18 23.34,13.97 U5.A8
OD_4
  Top 0.305: Q19.1 26.41,20.59 R48.2 26.37,19.86 26.04,19.53 24.29,19.53 23.81,19.05 U5.A10
OD_5
  Top 0.305: Q17.1 26.41,26.94 R44.2 26.37,26.21 26.19,26.04 23.65,26.04 20.48,29.21 U5.B3
OD_6
  Top 0.305: Q15.1 26.41,33.29 R41.2 26.37,32.56 26.19,32.38 24.13,32.38 22.23,34.29 U5.B5
RLY1-SW
  Top 0.61: D1.K 47.34,2.54 JP2.1 43.97,1.43 42.23,1.43 41.91,1.75 JP1.2
RLY1-SW1
  Top 0.61: D5.K 47.34,8.89 JP5.1 43.97,7.78 42.23,7.78 41.91,8.1 JP4.2
RLY1-SW2
  Top 0.61: D6.K 47.34,15.24 JP8.1 43.97,14.13 42.23,14.13 41.91,14.45 JP7.2
RLY1-SW3
  Top 0.61: D10.K 47.34,21.59 JP11.1 43.97,20.48 42.23,20.48 41.91,20.8 JP10.2
RLY1-SW4
  Top 0.61: D12.K 47.34,27.94 JP14.1 43.97,26.83 42.23,26.83 41.91,27.15 JP13.2
RLY1-SW5
  Top 0.61: D13.K 47.34,34.29 JP19.1 43.97,33.18 42.23,33.18 41.91,33.5 JP17.2
RLY1-SW6
  Top 0.61: D14.K 47.34,40.64 JP31.1 43.97,39.53 42.23,39.53 41.91,39.85 JP29.2
RLY1D
  Top 0.61: Q1.3 40.37,3.54 40.48,3.65 42.55,3.65 42.8,3.4 JP1.1
RLY1D1
  Top 0.61: Q5.3 40.37,9.89 40.48,10 42.55,10 42.8,9.75 JP4.1
RLY1D2
  Top 0.61: Q7.3 40.37,16.24 40.48,16.35 42.55,16.35 42.8,16.1 JP7.1
RLY1D3
  Top 0.61: Q11.3 40.37,22.59 40.48,22.7 42.55,22.7 42.8,22.45 JP10.1
RLY1D4
  Top 0.61: Q13.3 40.37,28.94 40.48,29.05 42.55,29.05 42.8,28.8 JP13.1
RLY1D5
  Top 0.61: Q16.3 40.37,35.29 40.48,35.4 42.55,35.4 42.8,35.15 JP17.1
RLY1D6
  Top 0.61: Q21.3 40.37,41.64 40.48,41.75 42.55,41.75 42.8,41.5 JP29.1
RLY1DG
  Top 0.61: Q1.1 36.83,1.86 Q2.3 37.35,4.6 39.05,4.6 39.23,4.43 R5.2 40.37,4.43 JP3.3
RLY1DG2
  Top 0.61: Q7.1 36.83,14.56 Q8.3 37.35,17.3 39.05,17.3 39.23,17.13 R19.2 40.37,17.13 JP9.3
RLY1DG3
  Top 0.61: Q11.1 36.83,20.91 Q12.3 37.35,23.65 39.05,23.65 39.23,23.48 R25.2 40.37,23.48 JP12.3
RLY1DG4
  Top 0.61: Q13.1 36.83,27.26 Q14.3 37.35,30 39.05,30 39.23,29.83 R38.2 40.37,29.83 JP15.3
RLY1DG5
  Top 0.61: Q16.1 36.83,33.61 Q18.3 37.51,36.51 38.89,36.51 39.23,36.18 R47.2 40.37,36.18 JP22.3
RLY1DG6
  Top 0.61: Q21.1 36.83,39.96 Q23.3 37.35,42.7 39.05,42.7 39.23,42.53 R55.2 40.37,42.53 JP34.3
RLY1SPLY
  Top 0.61: JP3.2 41.91,5.87 42.23,6.19 43.97,6.19 JP2.2 46.99,5.08 47.12,5.21 D1.A
RLY1SPLY1
  Top 0.61: JP6.2 41.91,12.22 42.23,12.54 43.97,12.54 JP5.2 47.34,11.43 D5.A
RLY1SPLY2
  Top 0.61: JP9.2 41.91,18.57 42.23,18.89 43.97,18.89 JP8.2 47.34,17.78 D6.A
RLY1SPLY3
  Top 0.61: JP12.2 41.91,24.92 42.23,25.24 43.97,25.24 JP11.2 47.34,24.13 D10.A
RLY1SPLY4
  Top 0.61: JP15.2 41.91,31.27 42.23,31.59 43.97,31.59 JP14.2 47.34,30.48 D12.A
RLY1SPLY5
  Top 0.61: JP22.2 41.91,37.62 42.23,37.94 43.97,37.94 JP19.2 47.34,36.83 D13.A
RLY1SPLY6
  Top 0.61: JP34.2 41.91,43.97 42.23,44.29 43.97,44.29 JP31.2 47.34,43.18 D14.A
RLY_1
  Top 0.305: Q2.1 37.78,6.03 36.83,5.08 35.88,5.08 35.56,4.76 | 35.56,4.76 R2.2 | U5.B13 30.32,6.35 30.96,6.99 33.34,6.99 35.56,4.76
RLY_2
  Top 0.305: Q6.1 37.78,12.38 36.83,11.43 35.88,11.43 35.56,11.11 35.56,10.95 | 35.56,10.95 R12.2 | U5.B15 23.5,11.43 24.61,12.54 30.16,12.54 30.96,13.34 33.18,13.34 35.56,10.95
RLY_3
  Top 0.305: Q8.1 37.78,18.73 36.83,17.78 35.88,17.78 35.56,17.46 | 35.56,17.46 R17.2 | U5.A9 22.38,16.51 24.61,18.73 29.84,18.73 30.8,19.68 33.34,19.68 35.56,17.46
RLY_4
  Top 0.305: Q12.1 37.78,25.08 36.83,24.13 35.88,24.13 35.56,23.81 | 35.56,23.81 R23.2 | U5.A15 21.59,26.67 22.86,25.4 30.48,25.4 31.11,26.04 33.34,26.04 35.56,23.81
RLY_5
  Top 0.305: Q14.1 37.78,31.43 36.83,30.48 35.88,30.48 35.56,30.16 | 35.56,30.16 R36.2 | U5.B4 30.48,31.75 31.11,32.38 33.34,32.38 35.56,30.16
RLY_6
  Top 0.305: Q18.1 37.78,37.78 36.83,36.83 35.88,36.83 35.56,36.51 | 35.56,36.51 R45.2 | U5.B6 23.81,36.83 25.08,38.1 30.48,38.1 30.96,38.58 33.5,38.58 35.56,36.51
RLY_7
  Top 0.305: Q23.1 37.78,44.13 36.83,43.18 35.88,43.18 35.56,42.86 R53.2 34.61,40.34 34.61,39.37 34.29,39.05 25.08,39.05 24.13,38.1 22.23,38.1 20.95,39.37 U5.B7
SSRX+
  Top 0.61: CON4.6-SSRX+ 6.6,92.81 7.14,93.44 42.31,93.44 CON3.6-SSRX+
SSRX-
  Top 0.61: CON4.5-SSRX- 6.64,94.81 7.14,94.2 42.35,94.2 CON3.5-SSRX-
SSTX+
  Top 0.61: CON4.9-SSTX+ 6.64,86.81 7.14,87.41 42.35,87.41 CON3.9-SSTX+
SSTX-
  Top 0.61: CON4.8-SSTX- 6.6,88.81 7.14,88.17 42.31,88.17 CON3.8-SSTX-
SW
  Top 0.61: U4.1 41.2,52.95 41.27,53.02
  Top 1.27: L1.2 43.62,53.78 43.18,53.34 | D11.A 43.18,53.34 | 41.27,53.02 42.86,53.02 43.18,53.34
USB2-EN  (via drill 0.33)
  Top 0.305: v10.16,62.23 11.1,62.23 R1.1 12.04,62.24 Q4.1
  Bottom 0.305: U5.B11 2.54,13.97 1.27,15.24 1.27,61.12 2.06,61.91 9.84,61.91 v10.16,62.23
USB2-ISNS  (via drill 0.33)
  Top 0.305: R16.2 12.7,72.71 12.06,72.07 v12.06,63.66 | C4.1 U5.B1
  Bottom 0.305: v12.06,63.66 12.06,60.64 10.32,58.9 10.32,37.31 9.68,36.67 9.68,35.4 10.32,34.77 10.32,30.64 7.62,27.94 4.29,27.94 3.02,26.67 3.02,19.84 3.81,19.05 U5.B1
USB2-ISNS-R
  Top 0.305: R14.2 9.84,76.99 10.95,78.11 U1.1 13.97,78.11 14.62,77.45 R16.1
USB2-TSNS  (via drill 0.33)
  Top 0.305: v8.89,34.29 v12.7,34.29 | J1.2 23.65,49.53 v23.5,49.37 | R9.1 v23.5,49.37 | v23.5,49.37 23.5,49.21 C3.1
  Bottom 0.305: U5.A3 v8.89,34.29 | v12.7,34.29 12.7,45.72 15.24,48.26 22.38,48.26 v23.5,49.37
USB2-VCC-SW
  Top 0.305: R3.2 42.72,63.52 43.66,64.45 43.66,66.18 CON1.1-5V
  Top 1.27: Q3.7 Q3.6 Q3.5 | Q3.7 Q3.8 | Q3.7 21.68,66.35 21.68,66.36 21.75,66.44 21.83,66.36 29.05,66.36 29.84,65.56 37.7,65.56 38.49,66.35 CON1.1-5V
USB2-VSNS
  Top 0.305: R3.1 R4.2 C2.1 21.1,62.22 18.1,59.21 13.02,59.21 12.06,58.26 12.06,54.29 13.02,53.34 13.02,48.26 12.06,47.31 12.06,36.67 14.76,33.97 14.76,22.07 14.29,21.59 U5.B0
USB2VIN  (via drill 0.33)
  Top 0.305: R7.2 10.64,71.36 11.11,71.83 R11.2 | D2.A 30.48,77.63 v29.05,76.2 | v16.51,71.44 v16.51,68.42
  Top 1.27: R8.2 R7.2 10.32,66.36 v9.53,66.36 v9.53,64.77 | 10.48,64.77 v9.53,64.77 | v9.53,64.77 9.53,64.93 9.84,65.41 9.84,65.25 v9.53,64.77 | D9.A 33.97,59.05 33.66,58.74 v33.5,58.74 v32.54,58.74
  Bottom 0.305: CON2.1-VCC 5.14,68.68 5.71,68.42 | v29.05,76.2 29.05,73.5 26.99,71.44 v16.51,71.44 | v16.51,68.42 16.51,68.26 14.61,66.36 v9.53,66.36
  Bottom 1.27: 5.71,68.42 8.57,65.56 v9.53,65.56 | v9.53,66.36 v9.53,65.56 | v9.53,65.56 v9.53,64.77 | v33.5,58.74 28.89,58.74 27.94,59.69 21.75,59.69 16.03,65.41 9.68,65.41 v9.53,65.56
USB3-EN
  Top 0.305: Q10.1 8.87,80.33 R20.1 7.95,80.03 7.46,79.53 7.46,68.9 6.99,68.42 6.99,64.45 6.03,63.5 2.22,63.5 1.59,62.87 1.59,17.14 2.22,16.51 U5.B10
USB3-ISNS  (via drill 0.33)
  Top 0.305: C14.1 U5.A7 3.81,24.13 2.54,25.4 2.54,31.75 3.81,33.02 6.35,33.02 7.62,34.29 7.62,53.34 5.08,55.88 5.08,61.91 5.71,62.55 7.3,62.55 8.26,63.5 8.26,67.63 8.57,67.94 v8.57,73.34 | R37.2 15.86,72.38 v15.72,72.23
  Bottom 0.305: v15.72,72.23 15.4,72.23 14.13,73.5 12.86,73.5 12.54,73.82 11.59,73.82 11.43,73.66 8.89,73.66 v8.57,73.34
USB3-ISNS-R  (via drill 0.33)
  Top 0.305: R34.2 20.34,77.48 19.68,76.83 U1.7 17.62,76.83 v17.14,76.36 | v17.62,72.55 R37.1
  Bottom 0.305: v17.14,76.36 17.14,73.03 v17.62,72.55
USB3-TSNS  (via drill 0.33)
  Top 0.305: R30.1 C11.1 | C11.1 27.32,40.66 J2.2 | C11.1 23.19,40.66 v23.18,40.64 | v13.97,41.91 v13.97,49.53 | v12.22,49.53 10.16,49.53 9.68,49.05 9.68,37.94 v8.57,36.83
  Bottom 0.305: v23.18,40.64 15.24,40.64 v13.97,41.91 | v13.97,49.53 v12.22,49.53 | v8.57,36.83 U5.A2
USB3-VCC-SW  (via drill 0.33)
  Top 0.305: R21.2 43.04,84.79 44.35,86.11 CON3.1-VBUS
  Top 1.27: Q9.8 Q9.7 | Q9.7 Q9.6 Q9.5 | Q9.7 34.77,83.82 v36.04,85.09
  Bottom 1.016: 43.34,85.09 44.35,86.11 CON3.1-VBUS
  Bottom 1.27: v36.04,85.09 43.34,85.09
USB3-VSNS  (via drill 0.33)
  Top 0.305: R21.1 R22.2 C6.1 37.13,83.49 36.04,82.39 36.04,73.5 v34.92,72.39 | v16.51,60.64 16.83,60.33 17.62,60.33 19.05,61.75 19.05,71.12 20,72.07 29.05,72.07 v29.21,71.91
  Bottom 0.305: v16.51,60.64 16.19,60.64 15.24,59.69 12.7,59.69 11.43,58.42 11.43,27.94 10.16,26.67 U5.A6 | v29.21,71.91 34.45,71.91 v34.92,72.39
USB3OUTVCC  (via drill 0.33)
  Top 0.305: R28.2 20.3,73.64 20,73.34 16.51,73.34 16.03,73.82 16.03,79.69 | 16.03,79.69 16.03,81.28 v15.88,81.44 | v10.95,81.6 R26.1 | R24.2 16.03,79.69
  Top 1.016: Q9.3 11.26,82.55 R26.1 | Q9.2 10.95,83.82 R27.1 11.58,85.09 Q9.1
  Top 1.27: 10.95,83.82 R26.1
  Bottom 0.305: v10.95,81.6 15.72,81.6 v15.88,81.44
USB3VIN  (via drill 0.33)
  Top 0.305: R29.2 v21.91,77.95 | R26.2 v8.1,81.6 | D3.A 27.62,79.06 26.67,80.01 v20.64,80.01
  Top 0.61: CON4.1-VBUS 6.17,87.81 v6.19,87.79 v5.4,87.79 v4.6,87.79
  Top 1.016: 7.62,82.55 8.1,83.03 R27.2 8.1,84.3 7.94,84.14 v6.99,84.14 v6.99,82.55 | 7.62,82.55 v6.99,82.55 | v6.99,82.55 6.99,82.71 7.62,83.34 | R26.2 7.94,82.23 7.62,82.55
  Top 1.27: D8.A 29.58,60.75 v29.37,60.96 v30.16,60.96 | v31.27,68.1 v30.48,68.1 37.62,68.1 38.1,68.58 v38.1,80.33 v38.1,81.12
  Bottom 0.305: v21.91,77.95 8.73,77.95 8.1,78.58 v8.1,81.6 8.73,81.6 10.32,80.01 v20.64,80.01
  Bottom 1.016: v4.6,87.79 v6.19,87.79 | v6.99,84.14 v6.99,83.34 v6.99,82.55
  Bottom 1.27: v6.19,87.79 6.19,84.93 v6.99,84.14 | v30.16,60.96 v29.37,60.96 29.37,66.99 v30.48,68.1 v31.27,68.1 | v38.1,80.33 v38.1,81.12 37.15,82.07 17.78,82.07 16.67,83.19 7.14,83.19 v6.99,83.34
USBBPIN  (via drill 0.33)
  Top 0.305: 19.53,5.08 21.11,5.08 | R18.1 12.71,30.18 v12.86,30.32 | D7.A 24.81,60.69 v25.4,61.28 | v25.4,67.94 26.83,67.94 30.48,71.6 30.48,72.39 29.84,73.03 25.24,73.03 24.77,73.5 D4.A
  Top 0.61: JP36.1 24.23,2.92 v24.13,3.02 24.13,4.13 23.18,5.08 21.11,5.08 | JP33.1 24.23,9.27 v24.13,9.37 | JP30.1 24.23,15.62 v24.13,15.72 | JP24.1 24.23,21.97 v24.13,22.07 | JP21.1 24.23,28.32 v24.13,28.42 | JP18.1 24.23,34.67 v24.13,34.77 | U3.3 8.89,4.75 C5.1 9.19,3.51 10.16,2.54 16.99,2.54 19.53,5.08 | C16.1 20.3,46.98 U5.5V
  Top 1.27: D7.A 24.81,55.29 22.86,53.34 | 22.86,53.34 22.23,52.7 22.23,47.47 21.75,46.99 U5.5V | JP28.3 19.05,55.88 20.32,54.61 21.59,54.61 22.86,53.34
  Bottom 0.305: v12.86,30.32 13.02,30.32 13.18,30.48 24.13,30.48 | v25.4,61.28 v25.4,67.94
  Bottom 0.61: v24.13,3.02 v24.13,9.37 v24.13,15.72 v24.13,22.07 v24.13,28.42 24.13,30.48 v24.13,34.77 24.13,46.83 23.97,46.99 U5.5V
USBOUTVCC  (via drill 0.33)
  Top 0.305: R10.2 9.84,72.07 v10,71.91 | v13.65,71.44 13.65,66.67 R7.1 | Q3.3 16.51,64.77 17.14,64.14 17.14,61.93 R6.2
  Top 1.016: Q3.1 14.12,67.31 R7.1 | Q3.3 13.8,64.77 R8.1 | Q3.2 13.49,66.04
  Top 1.27: R8.1 13.49,66.04 13.49,66.19 | 13.49,66.19 13.49,66.2 | R7.1 13.49,66.19
  Bottom 0.305: v10,71.91 13.18,71.91 v13.65,71.44
VUSBMAX
  Top 0.305: C1.1 18.73,79.69 18.82,79.6 U1.8 19.68,78.11 20.32,78.74 24.4,78.74 D4.K 24.77,77.47 25.88,76.36 26.51,76.36 27.62,75.25 D3.K D2.K

### Text on the board
tPlace: automation board v1.0 | Q9 | R27 | R26 | C6 | R22 | R21 | R24 | U1 | C1 | D4 | D3 | D2 | R20 | Q10 | R34 | R29 | R14 | R13 | R10 | R11 | R16 | R37 | R28 | R32 | Q3 | R7 | R8 | C2 | R4 | R3 | D8 | D9 | IO1 | IO2 | Q4 | R6 | R1 | L1 | I3 | D7 | C2 | C8 | C9 | A2 | A1 | R40 | D11 | C17 | U4 | R9 | R39 | R35 | C3 | C16 | C15 | C12 | Q23 | C13 | R33 | R55 | - | C10 | D14 | R30 | R53 | R31 | C11 | Q18 | Q21 | R47 | RL7 | R43 | CH | CL | - | 3V3 | D13 | OD6 | 5V | - | R41 | Q15 | R45 | Q14 | Q16 | U2 | R46 | R38 | CH | CL | RL6 | - | R18 | 3V3 | D12 | OD5 | 5V | C19 | - | R36 | R44 | Q17 | Q12 | Q13 | RL5 | C14 | 3V3 | R49 | R25 | CH | CL | - | R42 | R23 | OD4 | D10 | 5V | - | C4 | R48 | Q19 | Q8 | Q11 | RL4 | R51 | R19 | CH | CL | - | 3V3 | D6 | OD3 | 5V | - | R50 | Q20 | R17 | Q6 | R54 | Q7 | R15 | CH | CL | RL3 | - | 3V3 | D5 | OD2 | 5V | - | R12 | U3 | R52 | Q22 | Q2 | Q5 | RL2 | R57 | R5 | CH | CL | - | C18 | C5 | 3V3 | D1 | 5V | OD1 | - | R56 | Q24 | R2 | RL1 | Q1
bPlace: USB3.0 IN | USB3.0 OUT | USB2.0 IN | USB2.0 OUT | GND | 3V3 | 5V | 12V | TMP1 | TMP2
tStop: justin kenny 2020